# EAGLE design board (EAGLE 9.5.1)
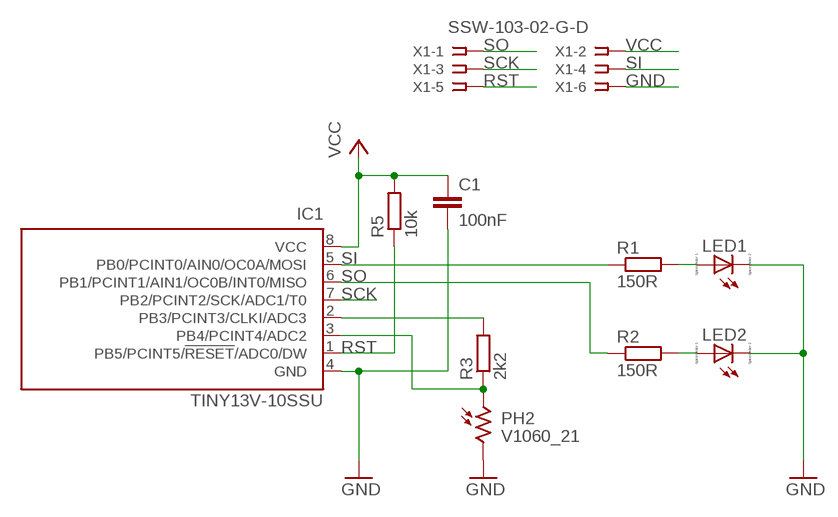
[diagram p0: schematic, sheet 1]

## Parts
C1  100nF  C-EUC1206K  [C1206K]
IC1  TINY13V-10SSU  [8S1]
LED1  LED_ESML0603  [LED_SML0603]
LED2  LED_ESML0603  [LED_SML0603]
PH2  V1060_21  [TO-5_V10]
R1  150R  R-EU_0204/5  [0204/5]
R2  150R  R-EU_0204/5  [0204/5]
R3  2k2  R-EU_0204/5  [0204/5]
R5  10k  R-EU_0204/5  [0204/5]
X1  SSW-103-02-G-D  [SSW-103-02-G-D]

## Nets
GND: C1.2 IC1.4(GND) LED1.C LED2.C PH2.2 X1.6
N$1: IC1.3(PB4/PCINT4/ADC2) PH2.1 R3.1
N$2: LED2.A R2.2
N$3: LED1.A R1.2
N$4: IC1.2(PB3/PCINT3/CLKI/ADC3) R3.2
RST: IC1.1(PB5/PCINT5/!RESET!/ADC0/DW) R5.1 X1.5
SCK: IC1.7(PB2/PCINT2/SCK/ADC1/T0) X1.3
SI: IC1.5(PB0/PCINT0/AIN0/OC0A/MOSI) R1.1 X1.4
SO: IC1.6(PB1/PCINT1/AIN1/OC0B/INT0/MISO) R2.1 X1.1
VCC: C1.1 IC1.8(VCC) R5.2 X1.2

## Library data of the parts
C1 = resistor:C-EU: CAPACITOR, European symbol
IC1 = atmel:TINY13: 8-bit AVR Microcontroller with 1K Bytes In-System Programmable Flash Source: http://www.atmel.com/dyn/resources/prod_documents/2535S.pdf; MPN: ATTINY13V-10SSU; OC_FARNELL: 1455135; OC_NEWARK: 58M3773
LED1 LED2 = eagle-ltspice:LED_E: LED Source: http://www.osram.convergy.de Source: www.luxeon.com Source: www.kingbright.com; SPICEMODEL: NONE; SPICEPREFIX: D; SPICETYPE: diode
PH2 = photo-elements:?1060*: Sensor Street Light control Source: http://optoelectronics.perkinelmer.com/content/Datasheets/DTS_PhotocellsB1060.pdf
R1-R3 R5 = resistor:R-EU_: RESISTOR, European symbol
X1 = con-samtec:SSW-103-02-G: THROUGH-HOLE .025" SQ POST SOCKET Source: Samtec SSW.pdf; MF: Samtec Inc.; MPN: SSW-103-02-G-D; OC_FARNELL: unknown; OC_NEWARK: 11P9365

## Board
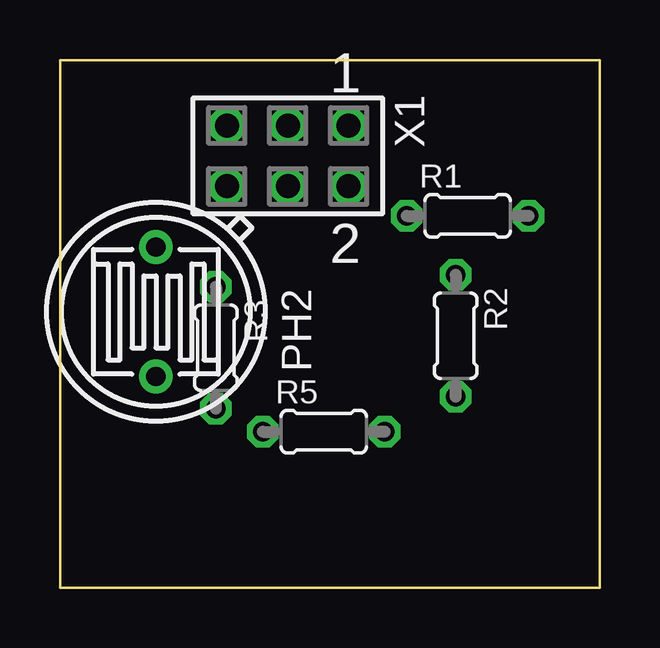
[diagram p1: board, top side]
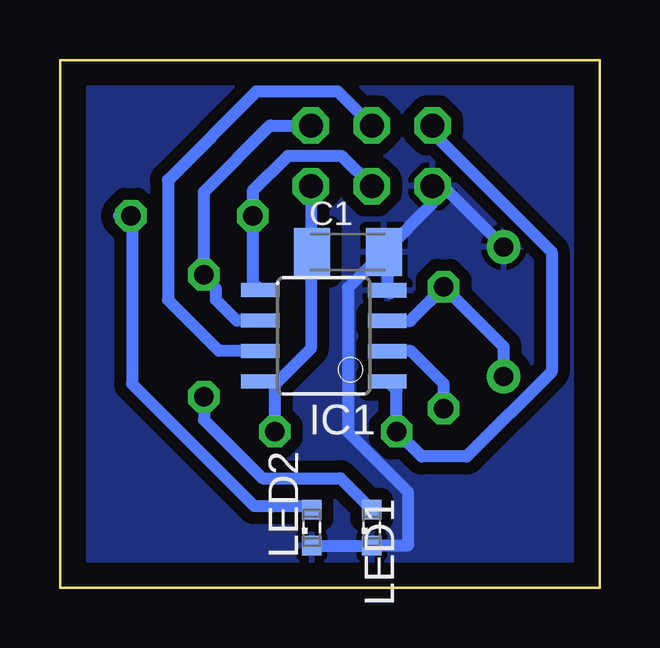
[diagram p2: board, bottom side, seen from below]

Size 22.5 x 22 mm. Coordinates in mm from the lower left corner, seen from the top.
Outline: 0,22 22.5,22 22.5,0 0,0 0,22
Copper layers (1*16): Top 0.035mm / dielectric 1.5mm / Bottom 0.035mm
Design rules "default": minimum track width 6mil, minimum drill 0.35mm, track to track 6mil, track to pad 6mil, pad to pad 6mil, via to via 6mil, smd to smd 6mil, copper to edge 40mil, drill to drill 6mil, minimum pad ring 10mil, minimum via ring 8mil, stop-mask expansion 4mil, vias tented up to drill 0mil, thermal gap 10mil

### Footprints (pad centres in the part's own frame; a part is rotated, then mirrored left to right if it is on the bottom)
C1206K = smd 1.5 x 2: 1 -1.5,0; 2 1.5,0
8S1 = smd 0.6 x 1.6: 1 -1.905,-2.654; 2 -0.645,-2.654; 3 0.625,-2.654; 4 1.895,-2.654; 5 1.905,2.654; 6 0.635,2.654; 7 -0.635,2.654; 8 -1.905,2.654
LED_SML0603 = smd 0.8 x 0.8: A 0.75,0; C -0.75,0
TO-5_V10 = drill 0.8 pad 1.4: 1 -2.7,0; 2 2.7,0
0204/5 = drill 0.813 octagon: 1 -2.54,0; 2 2.54,0
SSW-103-02-G-D = drill 1 pad 1.5 octagon: 1 -2.54,-1.27; 2 -2.54,1.27; 3 0,-1.27; 4 0,1.27; 5 2.54,-1.27; 6 2.54,1.27

### Placement (x,y rotation side)
C1  10.5,14 0 bottom
IC1  11.5,10.5 90 bottom
LED1  12,2.5 90 bottom
LED2  9.5,2.5 90 bottom
PH2  4,11.5 90 top
R1  17,15.5 0 top
R2  16.5,10.5 270 top
R3  6.5,10 270 top
R5  11,6.5 0 top
X1  9.5,18 180 top

### Tracks (layer width: path | path; a pad name or v marks a point on that pad's centre or on a via)
GND
  Bottom 0.5: 8.73,12.28 IC1.4 8.85,13.85 C1.2 | X1.6 6.96,16.04 C1.2 | X1.6 6.96,17.14 | LED1.C LED2.C 8,1.75 8,4 10.5,6.5 10.5,12.5 C1.2 | 6.69,16.73 X1.6 | PH2.2 6.53,16.73 X1.6
  pour Bottom (isolate 0.5): 0,22 22.5,22 22.5,0 0,0
N$1
  Bottom 0.5: IC1.3 7.91,11.12 | 7.91,11.12 7.88,11.12 | 7.91,11.12 7.02,12.02 | 7.02,12.02 R3.1 4,10.04 PH2.1 | 7.02,11.98 7.02,12.02
N$2
  Bottom 0.5: 16.54,8.19 16.63,8.09 R2.2 16.5,7 14.05,4.55 10.8,4.55 LED2.A
N$3
  Bottom 0.5: 20.04,15.5 R1.2 19.5,15.46 19.5,8.5 14.4,3.4 12.15,3.4 LED1.A
N$4
  Bottom 0.5: R3.2 6.5,8.5 7.86,9.86 IC1.2
RST
  Bottom 0.5: 8.35,8.59 IC1.1 8.46,8.21 R5.1 7.42,5.46 5.54,5.46 2,9 2,14 6.96,18.96 X1.5
SCK
  Bottom 0.5: X1.3 10.91,20.68 14.32,20.68 18,17 18,12 15.86,9.86 IC1.7
SI
  Bottom 0.5: IC1.5 14.3,12.55 14.46,12.5 R1.1 14.46,16.54 13,18 10.77,18 X1.4
SO
  Bottom 0.5: IC1.6 15.14,11.14 16,12 16,12.46 | 16,12.46 R2.1 | 16,12.46 16.5,12.96 16.5,16.5 13.73,19.27 X1.1
VCC
  Bottom 0.5: X1.2 12.04,14 | 12.04,14 12.04,9.96 13.41,8.59 IC1.8 13.65,8.59 13.54,8.48 R5.2 | C1.1 12.04,14